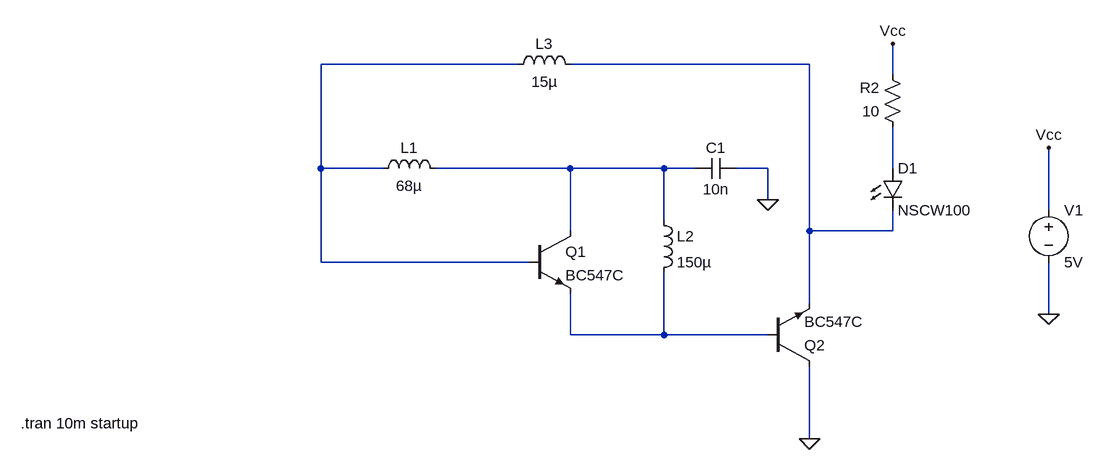
[diagram p0: schematic minati_fig5.asc]
minati_fig5.asc, the LTspice schematic file:
Version 4
SHEET 1 880 680
WIRE -208 -160 -512 -160
WIRE 240 -160 -128 -160
WIRE 368 -144 368 -192
WIRE -512 0 -512 -160
WIRE -416 0 -512 0
WIRE -128 0 -336 0
WIRE 16 0 -128 0
WIRE 64 0 16 0
WIRE 176 0 128 0
WIRE 368 0 368 -64
WIRE 176 48 176 0
WIRE 608 64 608 -32
WIRE 16 80 16 0
WIRE -128 96 -128 0
WIRE 240 96 240 -160
WIRE 368 96 368 64
WIRE 368 96 240 96
WIRE -512 144 -512 0
WIRE -192 144 -512 144
WIRE 240 208 240 96
WIRE 608 224 608 144
WIRE -128 256 -128 192
WIRE 16 256 16 160
WIRE 16 256 -128 256
WIRE 176 256 16 256
WIRE 240 416 240 304
FLAG 608 -32 Vcc
FLAG 608 224 0
FLAG 368 -192 Vcc
FLAG 240 416 0
FLAG 176 48 0
SYMBOL npn -192 96 R0
SYMATTR InstName Q1
SYMATTR Value BC547C
SYMBOL ind -432 16 R270
WINDOW 0 32 56 VTop 2
WINDOW 3 5 56 VBottom 2
SYMATTR InstName L1
SYMATTR Value 68µ
SYMBOL ind 0 64 R0
SYMATTR InstName L2
SYMATTR Value 150µ
SYMBOL cap 128 -16 R90
WINDOW 0 0 32 VBottom 2
WINDOW 3 32 32 VTop 2
SYMATTR InstName C1
SYMATTR Value 10n
SYMBOL voltage 608 48 R0
WINDOW 123 0 0 Left 0
WINDOW 39 0 0 Left 0
SYMATTR InstName V1
SYMATTR Value 5V
SYMBOL ind -224 -144 R270
WINDOW 0 32 56 VTop 2
WINDOW 3 5 56 VBottom 2
SYMATTR InstName L3
SYMATTR Value 15µ
SYMBOL res 384 -48 R180
WINDOW 0 36 76 Left 2
WINDOW 3 36 40 Left 2
SYMATTR InstName R2
SYMATTR Value 10
SYMBOL npn 176 304 M180
SYMATTR InstName Q2
SYMATTR Value BC547C
SYMBOL LED 352 0 R0
SYMATTR InstName D1
SYMATTR Value NSCW100
SYMATTR Description Diode
SYMATTR Type diode
TEXT -974 392 Left 2 !.tran 10m startup

The netlist it stands for:
* minati_fig5.asc
Q1 N003 N001 N005 0 BC547C
L1 N001 N003 68µ
L2 N003 N005 150µ
C1 0 N003 10n
V1 Vcc 0 5V
L3 N001 N002 15µ
R2 N004 Vcc 10
Q2 0 N005 N002 0 BC547C
D1 N004 N002 NSCW100
.model D D
.lib standard.dio
.model NPN NPN
.model PNP PNP
.lib standard.bjt
.tran 10m startup
.backanno
.end